# Altium project 28_Pin Project V1.1.PrjPcb (part 3 of 3)
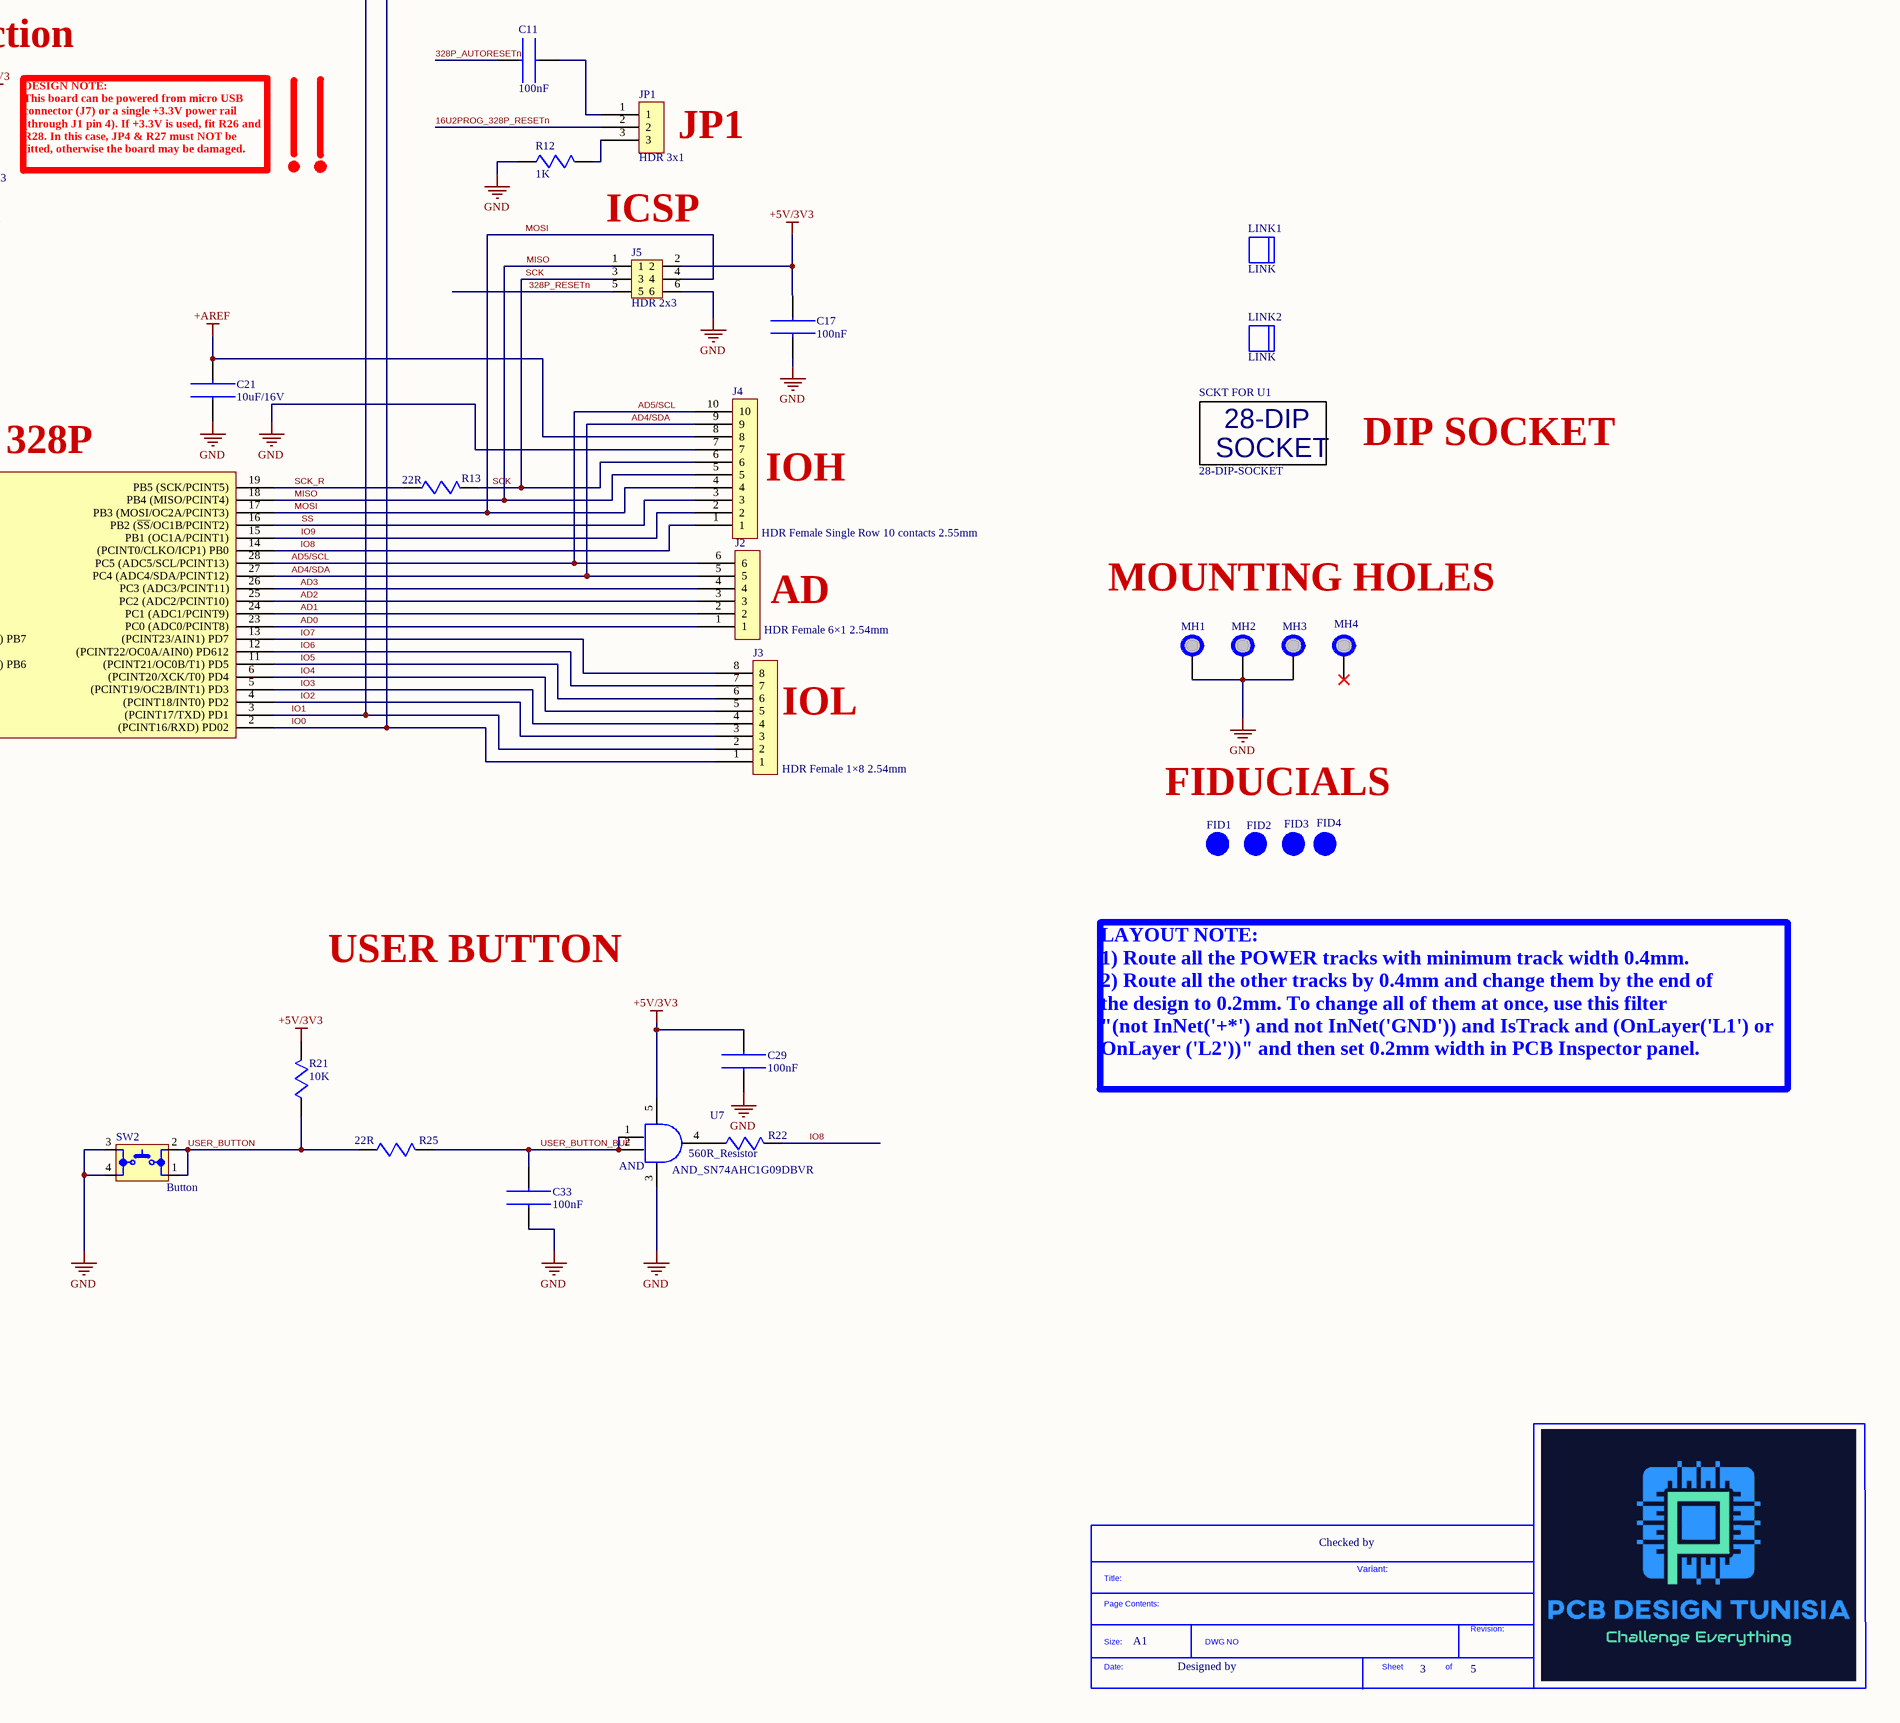
[diagram p8: [03] - 28PINS SHEMATIC.SchDoc, bottom right]

## Sheet [03] - 28PINS SHEMATIC.SchDoc: 28Pin (continued)

### Library data of the parts (continued)
R8 R26-R28 = RC0805JR-070RL: Surface Mount Thick Film Resistor, RC Series, 125 mW, - 5%, 150 V, 0805 [2012 Metric]; Manufacturer: Yageo; Resistance: 0mR; Power Rating: 125mW; Voltage Rating: 150V; Temperature Coefficient: 200ppm/°C; Manufacturer Part Number: RC0805JR-070RL; RoHS: Yes; Category: Chip SMD Resistors; Stock 1: 6616205; Pricing 1: 1=0,10000, 10=0,03300, 25=0,02400, 50=0,01840, 100=0,01350, 250=0,01032, 500=0,00824, 1000=0,00607 (USD); Case/Package: 0805; Number of Pins: 2; Contact Plating: Tin,Matte; Case Code (Imperial): 0805; Case Code (Metric): 2012; Min Operating Temperature: -55°C; Max Operating Temperature: 155°C; Composition: Thick Film; Tolerance: 5%; Packaging: Tape and Reel; Voltage Rating (DC): 150V; Termination: SMD/SMT; Military Standard: Not; Length: 2mm; Height: 0.5mm; Width: 1.25mm; Depth: 1.25mm; Radiation Hardening: No; REACH SVHC: Unknown; Lead Free: Lead Free; ComponentLink1URL: https://datasheet.ciiva.com/7941/1738694-7941861.pdf?src-supplier=Element14; ComponentLink1Description: https://datasheet.ciiva.com/7941/1738694-7941861.pdf?src-supplier=Element14; ComponentLink2URL: https://datasheet.ciiva.com/11819/0900766b8106beab-11819430.pdf?src-supplier=RSComponents; ComponentLink2Description: https://datasheet.ciiva.com/11819/0900766b8106beab-11819430.pdf?src-supplier=RSComponents; ComponentLink3URL: https://datasheet.ciiva.com/7941/1738694-7941862.pdf?src-supplier=Element14; ComponentLink3Description: https://datasheet.ciiva.com/7941/1738694-7941862.pdf?src-supplier=Element14; ComponentLink4URL: https://datasheet.ciiva.com/7941/1738694-7941863.pdf?src-supplier=Element14; ComponentLink4Description: https://datasheet.ciiva.com/7941/1738694-7941863.pdf?src-supplier=Element14; ComponentLink5URL: https://datasheet.ciiva.com/15190/getdatasheetpartid-330685-15190028.pdf?src-supplier=Verical; ComponentLink5Description: https://datasheet.ciiva.com/15190/getdatasheetpartid-330685-15190028.pdf?src-supplier=Verical; Supplier 1: Digi-Key; Supplier Part Number 1: 311-0.0ARCT-ND
R9 R16 = RC0805FR-071ML: Res Thick Film 0805 1M Ohm 1% 0.125W(1/8W) ±100ppm/C Epoxy SMD T/R; Manufacturer: Yageo Phycomp; Temperature Coefficient: 100ppm/°C; Resistance: 1MR; Power Rating: 125mW; Voltage Rating (DC): 150V; Manufacturer Part Number: RC0805FR-071ML; RoHS: Yes; Category: Chip SMD Resistors; Stock 1: 3012562; Pricing 1: 1=0,10000, 10=0,03900, 100=0,01570, 1000=0,00705, 2500=0,00612 (USD); Mount: Surface Mount; Case/Package: 0805; Number of Pins: 2; Min Operating Temperature: -55°C; Max Operating Temperature: 155°C; Tolerance: 1%; Packaging: Cut Tape; Length: 2mm; Height: 0.5mm; Width: 1.25mm; Depth: 1.25mm; REACH SVHC: No SVHC; Lead Free: Lead Free; ComponentLink1URL: http://www.farnell.com/datasheets/2167052.pdf?src-supplier=Farnell; ComponentLink1Description: http://www.farnell.com/datasheets/2167052.pdf?src-supplier=Farnell; ComponentLink2URL: http://www.mouser.com/ds/2/447/Yageo_08112016_RC0805-968729.pdf?src-supplier=Mouser; ComponentLink2Description: http://www.mouser.com/ds/2/447/Yageo_08112016_RC0805-968729.pdf?src-supplier=Mouser; ComponentLink3URL: http://www.farnell.com/datasheets/444164.pdf?src-supplier=Element14; ComponentLink3Description: http://www.farnell.com/datasheets/444164.pdf?src-supplier=Element14; ComponentLink4URL: http://www.farnell.com/datasheets/2167052.pdf?src-supplier=Newark; ComponentLink4Description: http://www.farnell.com/datasheets/2167052.pdf?src-supplier=Newark; ComponentLink5URL: http://www.yageo.com/documents/recent/PYu-RC_Group_51_RoHS_L_10.pdf?src-supplier=Digi-Key; ComponentLink5Description: http://www.yageo.com/documents/recent/PYu-RC_Group_51_RoHS_L_10.pdf?src-supplier=Digi-Key; Supplier 1: Digi-Key; Supplier Part Number 1: 311-1.00MCRDKR-ND
R10-R12 = RC0805FR-071KL: RESISTOR, 0805 1K 1%, FULL REEL; Product Range:YAGEO - RC Series; Resistance:1kohm; Power Rating:125mW; Resistance Tolerance:± 1%; Resistor Case Style:0805 [2012 Metric]; Resistor Element Material:Thick Film; Temperature Coefficient:± 250ppm/°C; Voltage Rating:150V; Packaging:Tape & Reel; MSL:-; SVHC:No SVHC (16-Dec-2013); External Depth:0.55mm; External Length / Height:2mm; External Width:1.25mm; No. of Pins:2; Operating Temperature Max:155°C; Operating Temperature Min:-55°C; Operating Temperature Range:-55°C to +155°C; Reel Quantity:5000; Resistor Mounting:SMD; Series:RC12H; Temperature Coef; Manufacturer: Yageo; Resistance: 1kR; Temperature Coefficient: 100ppm/°C; Voltage Rating (DC): 150V; Power Rating: 125mW; Manufacturer Part Number: RC0805FR-071KL; RoHS: Yes; Category: Chip SMD Resistors; Stock 1: 17484897; Pricing 1: 1=0,10000, 10=0,03900, 100=0,01570, 1000=0,00705, 2500=0,00612 (USD); Case/Package: 0805; Number of Pins: 2; Case Code (Metric): 2012; Case Code (Imperial): 0805; Min Operating Temperature: -55°C; Max Operating Temperature: 155°C; Tolerance: 1%; Packaging: Tape and Reel; Composition: Thick Film; Package Quantity: 1; Voltage Rating: 150V; Number of Terminations: 2; Termination: SMD/SMT; Military Standard: Not; Max Power Dissipation: 125mW; Features: Moisture Resistant; Length: 0.079inch; Height: 0.024inch; Width: 0.049inch; Depth: 1.25mm; REACH SVHC: Unknown; Lead Free: Lead Free; ComponentLink1URL: https://datasheet.ciiva.com/2456/pyu-r-int-thick-7-2456976.pdf?src-supplier=Digi-Key; ComponentLink1Description: https://datasheet.ciiva.com/2456/pyu-r-int-thick-7-2456976.pdf?src-supplier=Digi-Key; ComponentLink2URL: https://datasheet.ciiva.com/2456/pyu-r-int-thick-7-2456977.pdf?src-supplier=Digi-Key; ComponentLink2Description: https://datasheet.ciiva.com/2456/pyu-r-int-thick-7-2456977.pdf?src-supplier=Digi-Key; ComponentLink3URL: https://datasheet.ciiva.com/7941/1686128-7941719.pdf?src-supplier=Element14; ComponentLink3Description: https://datasheet.ciiva.com/7941/1686128-7941719.pdf?src-supplier=Element14; ComponentLink4URL: https://datasheet.ciiva.com/16850/rc0805-16850409.pdf?src-supplier=Future+Electronics; ComponentLink4Description: https://datasheet.ciiva.com/16850/rc0805-16850409.pdf?src-supplier=Future+Electronics; ComponentLink5URL: https://datasheet.ciiva.com/46385/444164-46385020.pdf?src-supplier=Element14; ComponentLink5Description: https://datasheet.ciiva.com/46385/444164-46385020.pdf?src-supplier=Element14; ComponentLink6URL: https://datasheet.ciiva.com/2456/pyu-r-int-thick-7-2456975.pdf?src-supplier=Digi-Key; ComponentLink6Description: https://datasheet.ciiva.com/2456/pyu-r-int-thick-7-2456975.pdf?src-supplier=Digi-Key; Supplier 1: Digi-Key; Supplier Part Number 1: 311-1.00KCRCT-ND
SCKT_FOR_U1 = 4828-3004-CP: CONN IC DIP SOCKET 28POS TIN; Manufacturer: 3M; Number of Contacts: 28; Gender: Female; Insulation Resistance: 5GR; Connector Type: DIP,Socket; Current Rating: 1A; Pitch: 2.54mm; Row Spacing: 7.62mm; Manufacturer Part Number: 4828-3004-CP; RoHS: Yes; Category: Connectors; Stock 1: 4184; Pricing 1: 1=0,79000, 10=0,69300, 25=0,65240, 50=0,62540, 100=0,59820, 250=0,54380, 500=0,48942, 1000=0,43504, 2500=0,39426 (USD); Mount: Through Hole; Contact Material: Bronze; Contact Plating: Tin; Housing Material: Glass; Min Operating Temperature: -25°C; Max Operating Temperature: 85°C; Termination: Solder; Orientation: Straight; Number of Rows: 2; Number of Positions: 28; Package Quantity: 5600; Length: 35.43mm; Depth: 5.08mm; Width: 10.16mm; REACH SVHC: Unknown; Lead Free: Lead Free; ComponentLink1URL: https://datasheet.ciiva.com/768/ts1099-768354.pdf?src-supplier=Digi-Key; ComponentLink1Description: https://datasheet.ciiva.com/768/ts1099-768354.pdf?src-supplier=Digi-Key; Supplier 1: Digi-Key; Supplier Part Number 1: 3M5480-ND
SW1 SW2 = 1825910-6: SWITCH TACTILE SPST-NO 0.05A 24V; Manufacturer: TE Connectivity Alcoswitch; Actuator Material: PBT; Mechanical Life: 100000Cycles; Operating Force: 160gf; Throw Configuration: SPST; Illumination Type: Non-Illuminated,Illuminated; Switch Travel: 0.25mm; Switch Function: Off-Mom; Contact Current Rating: 50mA; Actuator Type: Standard; Contact Resistance: 100mR; Actuator Length: 0.055inch; Manufacturer Part Number: 1825910-6; RoHS: Yes; Category: Pushbutton Switches; Stock 1: 97530; Pricing 1: 1=0,10000, 10=0,10100, 25=0,09560, 100=0,08700, 250=0,08180, 500=0,07484, 1000=0,06265, 2500=0,06092, 5000=0,05743 (USD); Mount: Through Hole; Contact Material: Copper Alloy; Contact Plating: Silver; Min Operating Temperature: -35°C; Max Operating Temperature: 85°C; Termination: PC Pins; Package Quantity: 750; Packaging: Loose Piece; Orientation: Straight; Max Voltage Rating (DC): 24V; Electrical Life: 100000Cycles; Max Current Rating: 50mA; Type: Switch; Length: 5.99mm; REACH SVHC: Unknown; ELV: Compliant; Lead Free: Lead Free; ComponentLink1URL: https://datasheet.ciiva.com/30199/1825910-6rqpn1825910-6-30199520.pdf?src-supplier=Onlinecomponents.com; ComponentLink1Description: https://datasheet.ciiva.com/30199/1825910-6rqpn1825910-6-30199520.pdf?src-supplier=Onlinecomponents.com; ComponentLink2URL: https://datasheet.ciiva.com/15184/getdatasheetpartid-395915-15184509.pdf?src-supplier=Verical; ComponentLink2Description: https://datasheet.ciiva.com/15184/getdatasheetpartid-395915-15184509.pdf?src-supplier=Verical; Supplier 1: Digi-Key; Supplier Part Number 1: 450-1650-ND
U1 = ATMEGA328P-PU: ATMEGA328P-PU; 8 bit Microcontroller AVR 20MHz 1; 32kb Flash; 2kb RAM; I2C SPI 2; Manufacturer: Microchip / Atmel; Number of PWM Channels: 6; Number of Timers/Counters: 3; Min Supply Voltage: 1.8V; Max Supply Voltage: 5.5V; Interface: I2C,SPI,UART,USART,2-Wire; Number of I/Os: 23; Oscillator Type: Internal; Data Bus Width: 8b; Number of SPI Channels: 1; Watchdog Timer: Yes; Peripherals: Brown-out Detect/Reset,POR,PWM,WDT; Manufacturer Part Number: ATMEGA328P-PU; RoHS: Yes; Category: Microcontrollers; Stock 1: 5280; Pricing 1: 1=2,08000, 25=1,91000, 100=1,73000 (USD); Mount: Through Hole; Case/Package: PDIP; Number of Pins: 28; Contact Plating: Tin,Matte; Min Operating Temperature: -40°C; Max Operating Temperature: 85°C; Package Quantity: 14; Core Architecture: AVR; RAM Size: 2KB; Number of ADC Channels: 6; Packaging: Rail/Tube; Frequency: 20MHz; Number of Programmable I/O: 23; Max Frequency: 20MHz; Number of I2C Channels: 1; Memory Type: FLASH; Memory Size: 32KB; Length: 37.4mm; Height: 3.28mm; Width: 6.76mm; Radiation Hardening: No; REACH SVHC: No SVHC; Lead Free: Lead Free; ComponentLink1URL: https://datasheet.ciiva.com/20168/73-4283-20168380.pdf?src-supplier=Rapid+Electronics; ComponentLink1Description: https://datasheet.ciiva.com/20168/73-4283-20168380.pdf?src-supplier=Rapid+Electronics; ComponentLink2URL: https://datasheet.ciiva.com/19457/2139111-19457070.pdf?src-supplier=Jameco; ComponentLink2Description: https://datasheet.ciiva.com/19457/2139111-19457070.pdf?src-supplier=Jameco; ComponentLink3URL: https://datasheet.ciiva.com/1157/1684409-1157696.pdf?src-supplier=Element14; ComponentLink3Description: https://datasheet.ciiva.com/1157/1684409-1157696.pdf?src-supplier=Element14; ComponentLink4URL: https://datasheet.ciiva.com/26818/atmega328p-pu-26818578.pdf?src-supplier=IIIC; ComponentLink4Description: https://datasheet.ciiva.com/26818/atmega328p-pu-26818578.pdf?src-supplier=IIIC; ComponentLink5URL: https://datasheet.ciiva.com/29119/155197-da-01-en-microcontr-atmega328p-pu-8bit-pdip-28-29119593.pdf?src-supplier=Conrad; ComponentLink5Description: https://datasheet.ciiva.com/29119/155197-da-01-en-microcontr-atmega328p-pu-8bit-pdip-28-29119593.pdf?src-supplier=Conrad; ComponentLink6URL: https://datasheet.ciiva.com/15213/getdatasheetpartid-318533-15213133.pdf?src-supplier=Verical; ComponentLink6Description: https://datasheet.ciiva.com/15213/getdatasheetpartid-318533-15213133.pdf?src-supplier=Verical; Supplier 1: Digi-Key; Supplier Part Number 1: ATMEGA328P-PU-ND
U2 = ATMEGA16U2-AU: MICROCHIP - ATMEGA16U2-AU - MCU, 8BIT, MEGAAVR, 16MHZ, TQFP-32; Manufacturer: Microchip / Atmel; Core Architecture: AVR; Interface: SPI,UART,USB,USART,Serial; Number of I/Os: 22; Data Bus Width: 8b; Oscillator Type: Internal; Memory Type: FLASH; Memory Size: 16KB; Peripherals: Brown-out Detect/Reset,POR,PWM,WDT; RAM Size: 512B; Number of Timers/Counters: 2; Max Supply Voltage: 5.5V; Min Supply Voltage: 2.7V; Number of PWM Channels: 5; Number of SPI Channels: 1; Watchdog Timer: Yes; Manufacturer Part Number: ATMEGA16U2-AU; RoHS: Yes; Category: Microcontrollers; Stock 1: 898; Pricing 1: 1=2,45000, 25=2,25000, 100=2,04000 (USD); Mount: Surface Mount; Case/Package: A; Number of Pins: 32; Contact Plating: Tin,Matte; Min Operating Temperature: -40°C; Max Operating Temperature: 85°C; Package Quantity: 1250; Frequency: 16MHz; Packaging: Tray; Number of Programmable I/O: 22; Max Frequency: 16MHz; Length: 7mm; Height: 1.05mm; Width: 7mm; REACH SVHC: No SVHC; Lead Free: Lead Free; ComponentLink1URL: https://datasheet.ciiva.com/13036/doc7799-28769-13036800.pdf?src-supplier=Mouser; ComponentLink1Description: https://datasheet.ciiva.com/13036/doc7799-28769-13036800.pdf?src-supplier=Mouser; ComponentLink2URL: https://datasheet.ciiva.com/22651/doc7799-22651110.pdf?src-supplier=Farnell; ComponentLink2Description: https://datasheet.ciiva.com/22651/doc7799-22651110.pdf?src-supplier=Farnell; Supplier 1: Digi-Key; Supplier Part Number 1: ATMEGA16U2-AU-ND
U3 = TL1963A-33DCQR: IC REG LINEAR 3.3V 1.5A SOT223-6; Manufacturer: Texas Instruments; Dropout Voltage: 340mV; Number of Outputs: 1; Max Input Voltage: 20V; Min Input Voltage: 2.1V; Min Current Limit: 1.6A; Input Bias Current: 1mA; Polarity: Positive; Accuracy: 3%; Output Type: Fixed; Manufacturer Part Number: TL1963A-33DCQR; RoHS: Yes; Category: Voltage Regulators - Linear; Stock 1: 2996; Pricing 1: 1=2,80000, 10=2,51300, 25=2,37600, 100=1,95360, 250=1,75296, 500=1,68960, 1000=1,40448 (USD); Case/Package: SOT-223; Number of Pins: 6; Contact Plating: Gold; Min Operating Temperature: -40°C; Max Operating Temperature: 125°C; Package Quantity: 1; Packaging: Tape and Reel; Output Voltage: 3.3V; Output Current: 1.5A; Max Output Current: 1.5A; Number of Regulators: 1; Quiescent Current: 1mA; Max Output Voltage: 3.3V; Min Output Voltage: 3.3V; Radiation Hardening: No; Lead Free: Lead Free; ComponentLink1URL: https://datasheet.ciiva.com/2046/tl1963a-2046161.pdf?src-supplier=Digi-Key; ComponentLink1Description: https://datasheet.ciiva.com/2046/tl1963a-2046161.pdf?src-supplier=Digi-Key; ComponentLink2URL: https://datasheet.ciiva.com/2046/tl1963a-2046162.pdf?src-supplier=Digi-Key; ComponentLink2Description: https://datasheet.ciiva.com/2046/tl1963a-2046162.pdf?src-supplier=Digi-Key; ComponentLink3URL: https://datasheet.ciiva.com/2046/tl1963a-2046163.pdf?src-supplier=Digi-Key; ComponentLink3Description: https://datasheet.ciiva.com/2046/tl1963a-2046163.pdf?src-supplier=Digi-Key; ComponentLink4URL: https://datasheet.ciiva.com/26176/tl1963a-25-26176569.pdf?src-supplier=Avnet+Europe; ComponentLink4Description: https://datasheet.ciiva.com/26176/tl1963a-25-26176569.pdf?src-supplier=Avnet+Europe; Supplier 1: Digi-Key; Supplier Part Number 1: 296-24534-1-ND
U4-U7 = SN74AHC1G09DBVR: TEXAS INSTRUMENTS - SN74AHC1G09DBVR - AND Gate, 74AHC1G09, 2 Input, 2 V to 5.5 V, SOT-23-5; Min Supply Voltage: 2V; Max Supply Voltage: 5.5V; Quiescent Current: 1uA; Number of Inputs: 2; Propagation Delay: 7.5ns; Output Current: 25mA; Number of Circuits: 1; Low Level Output Current: 8mA; Manufacturer: Texas Instruments; Manufacturer Part Number: SN74AHC1G09DBVR; RoHS: Yes; Category: Logic Gates; Stock 1: 30722; Pricing 1: 1=0,32000, 10=0,24000, 25=0,21000, 100=0,13590, 250=0,11252, 500=0,09000, 1000=0,06900 (USD); Mount: Surface Mount; Case/Package: SOT-23; Number of Pins: 5; Contact Plating: Tin,Matte; Min Operating Temperature: -55°C; Max Operating Temperature: 125°C; Logic Function: AND; Package Quantity: 3000; Packaging: Tape and Reel; Number of Gates: 1; Number of Elements: 1; Number of Bits: 1; Output Voltage: 5.5V; Number of Outputs: 1; Radiation Hardening: No; REACH SVHC: No SVHC; Lead Free: Lead Free; ComponentLink1URL: https://datasheet.ciiva.com/1864/sn74ahc1g09-1864410.pdf?src-supplier=Digi-Key; ComponentLink1Description: https://datasheet.ciiva.com/1864/sn74ahc1g09-1864410.pdf?src-supplier=Digi-Key; ComponentLink2URL: https://datasheet.ciiva.com/1864/sn74ahc1g09-1864411.pdf?src-supplier=Digi-Key; ComponentLink2Description: https://datasheet.ciiva.com/1864/sn74ahc1g09-1864411.pdf?src-supplier=Digi-Key; ComponentLink3URL: https://datasheet.ciiva.com/1864/sn74ahc1g09-1864412.pdf?src-supplier=Digi-Key; ComponentLink3Description: https://datasheet.ciiva.com/1864/sn74ahc1g09-1864412.pdf?src-supplier=Digi-Key; Supplier 1: Digi-Key; Supplier Part Number 1: 296-29202-1-ND
Y1 Y2 = ABM7-16.000MHZ-D2Y-T: CRYSTAL 16.0000MHZ 18PF SMD; Manufacturer: Abracon; Frequency Tolerance: 20ppm; Frequency: 16MHz; Frequency Stability: 30ppm; ESR (Equivalent Series Resistance): 50R; Manufacturer Part Number: ABM7-16.000MHZ-D2Y-T; RoHS: Yes; Category: Crystals; Stock 1: 61578; Pricing 1: 1=1,00000, 10=0,88600, 50=0,82780, 100=0,73150, 500=0,69300 (USD); Mount: Surface Mount; Case/Package: CSMD; Number of Pins: 2; Min Operating Temperature: -40°C; Max Operating Temperature: 85°C; Load Capacitance: 18pF; Packaging: Tape and Reel; Package Quantity: 1000; Tolerance: 20ppm; Termination: SMD/SMT; Composition: Ceramic; Length: 6mm; Height: 0.055inch; Width: 3.3mm; Depth: 3.5mm; Radiation Hardening: No; REACH SVHC: Unknown; Lead Free: Lead Free; ComponentLink1URL: https://datasheet.ciiva.com/15116/getdatasheetpartid-721624-15116835.pdf?src-supplier=Verical; ComponentLink1Description: https://datasheet.ciiva.com/15116/getdatasheetpartid-721624-15116835.pdf?src-supplier=Verical; ComponentLink2URL: https://datasheet.ciiva.com/22658/947971-22658293.pdf?src-supplier=Element14; ComponentLink2Description: https://datasheet.ciiva.com/22658/947971-22658293.pdf?src-supplier=Element14; ComponentLink3URL: https://datasheet.ciiva.com/5788/abm7-5788054.pdf?src-supplier=Farnell; ComponentLink3Description: https://datasheet.ciiva.com/5788/abm7-5788054.pdf?src-supplier=Farnell; ComponentLink4URL: https://datasheet.ciiva.com/7998/947971-7998600.pdf?src-supplier=Element14; ComponentLink4Description: https://datasheet.ciiva.com/7998/947971-7998600.pdf?src-supplier=Element14; ComponentLink5URL: https://datasheet.ciiva.com/46385/947971-46385243.pdf?src-supplier=Element14; ComponentLink5Description: https://datasheet.ciiva.com/46385/947971-46385243.pdf?src-supplier=Element14; ComponentLink6URL: https://datasheet.ciiva.com/16383/abm7-16383174.pdf?src-supplier=Future+Electronics; ComponentLink6Description: https://datasheet.ciiva.com/16383/abm7-16383174.pdf?src-supplier=Future+Electronics; ComponentLink7URL: https://datasheet.ciiva.com/18649/abm7-18649865.pdf?src-supplier=Digi-Key; ComponentLink7Description: https://datasheet.ciiva.com/18649/abm7-18649865.pdf?src-supplier=Digi-Key; ComponentLink8URL: https://datasheet.ciiva.com/18649/abm7-18649866.pdf?src-supplier=Digi-Key; ComponentLink8Description: https://datasheet.ciiva.com/18649/abm7-18649866.pdf?src-supplier=Digi-Key; ComponentLink9URL: https://datasheet.ciiva.com/18649/abm7-18649867.pdf?src-supplier=Digi-Key; ComponentLink9Description: https://datasheet.ciiva.com/18649/abm7-18649867.pdf?src-supplier=Digi-Key; ComponentLink10URL: https://datasheet.ciiva.com/26941/getdatasheetpartid-719818-26941724.pdf?src-supplier=Verical; ComponentLink10Description: https://datasheet.ciiva.com/26941/getdatasheetpartid-719818-26941724.pdf?src-supplier=Verical; Supplier 1: Digi-Key; Supplier Part Number 1: 535-9840-1-ND
Z1 Z2 = CG0603MLC-05E: VARISTOR 0603; Manufacturer: Bourns; Capacitance: 0.5pF; Voltage Rating (DC): 5V; Voltage Rating (AC): 8V; Number of Channels: 1; Clamping Voltage: 20V; Current Rating: 50nA; Turn-On Delay Time: 1ns; Element Configuration: Single; Manufacturer Part Number: CG0603MLC-05E; RoHS: Yes; Category: Varistors; Stock 1: 111155; Pricing 1: 1=0,10000, 25=0,06600, 100=0,06430 (USD); Case/Package: 0603; Number of Pins: 2; Case Code (Imperial): 0603; Case Code (Metric): 1608; Contact Plating: Tin; Min Operating Temperature: -40°C; Max Operating Temperature: 85°C; Operating Supply Voltage: 5V; Package Quantity: 1; Packaging: Tape and Reel; Termination: SMD/SMT; Voltage: 5V; Number of Circuits: 1; Max Voltage Rating (DC): 5V; Working Voltage: 5V; Leakage Current: 50nA; Length: 1.6mm; Width: 0.8mm; Depth: 0.8mm; Thickness: 0.8mm; Radiation Hardening: No; REACH SVHC: No SVHC; ComponentLink1URL: https://datasheet.ciiva.com/27747/1163231-27747629.pdf?src-supplier=Jameco; ComponentLink1Description: https://datasheet.ciiva.com/27747/1163231-27747629.pdf?src-supplier=Jameco; ComponentLink2URL: https://datasheet.ciiva.com/30070/mlc-30070503.pdf?src-supplier=Onlinecomponents.com; ComponentLink2Description: https://datasheet.ciiva.com/30070/mlc-30070503.pdf?src-supplier=Onlinecomponents.com; ComponentLink3URL: https://datasheet.ciiva.com/6991/mlc-6991832.pdf?src-supplier=Digi-Key; ComponentLink3Description: https://datasheet.ciiva.com/6991/mlc-6991832.pdf?src-supplier=Digi-Key; ComponentLink4URL: https://datasheet.ciiva.com/6991/mlc-6991834.pdf?src-supplier=Digi-Key; ComponentLink4Description: https://datasheet.ciiva.com/6991/mlc-6991834.pdf?src-supplier=Digi-Key; ComponentLink5URL: https://datasheet.ciiva.com/6991/mlc-6991836.pdf?src-supplier=Digi-Key; ComponentLink5Description: https://datasheet.ciiva.com/6991/mlc-6991836.pdf?src-supplier=Digi-Key; ComponentLink6URL: https://datasheet.ciiva.com/1278/1785244-1278701.pdf?src-supplier=Element14; ComponentLink6Description: https://datasheet.ciiva.com/1278/1785244-1278701.pdf?src-supplier=Element14; ComponentLink7URL: https://datasheet.ciiva.com/22696/1785244-22696318.pdf?src-supplier=Element14; ComponentLink7Description: https://datasheet.ciiva.com/22696/1785244-22696318.pdf?src-supplier=Element14; ComponentLink8URL: https://datasheet.ciiva.com/25958/mlc-25958222.pdf?src-supplier=Avnet+Europe; ComponentLink8Description: https://datasheet.ciiva.com/25958/mlc-25958222.pdf?src-supplier=Avnet+Europe; ComponentLink9URL: https://datasheet.ciiva.com/8084/mlc-8084047.pdf?src-supplier=Avnet; ComponentLink9Description: https://datasheet.ciiva.com/8084/mlc-8084047.pdf?src-supplier=Avnet; Supplier 1: Digi-Key; Supplier Part Number 1: CG0603MLC-05ECT-ND

## Sheet [04] - REVISION HISTORY.SchDoc: 28Pin
size A3; DocumentNumber: 4; SheetNumber: 4; SheetTotal: 5
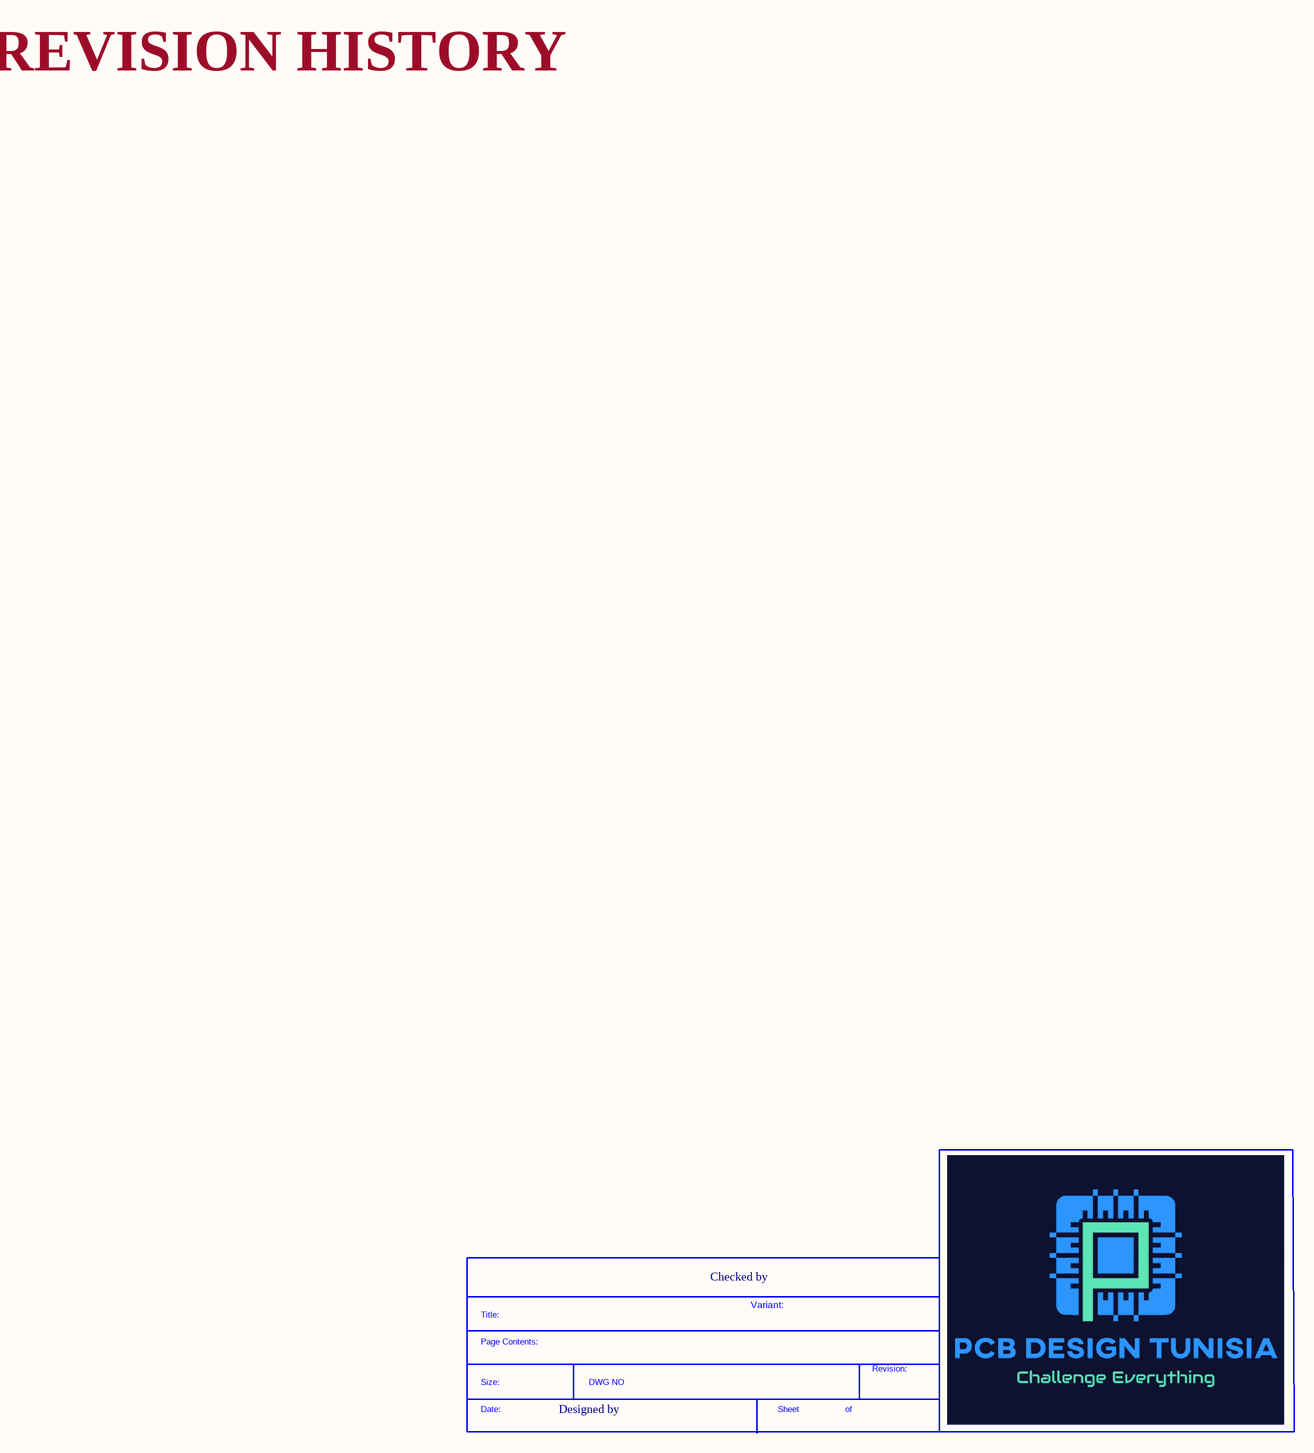
[diagram p6: [04] - REVISION HISTORY.SchDoc]

### Parts
(Parts that share a designator on the sheet are numbered #1, #2 ... from top to bottom, then left to right.)
*?#3  SDTitleBlock  (value not drawn)  (graphical)

### Notes on the sheet
- REVISION HISTORY
- Checked by
- Variant:
- Designed by
- (in symbol SDTitleBlock) Title:; Page Contents:; Revision:; Size:; DWG NO; Date:; Sheet; of

## Assembly variants
FIXED 5V: not fitted JP2 JP4 LINK3 R26 R28
5V/3V3: not fitted JP2 R26 R27 R28; alternate parts Y1 -> ABM7-10.000MHZ-D2Y-T, Y2 -> ABM7-8.000MHZ-D2Y-T